# Altium schematic sheet MCU.SchDoc
size A
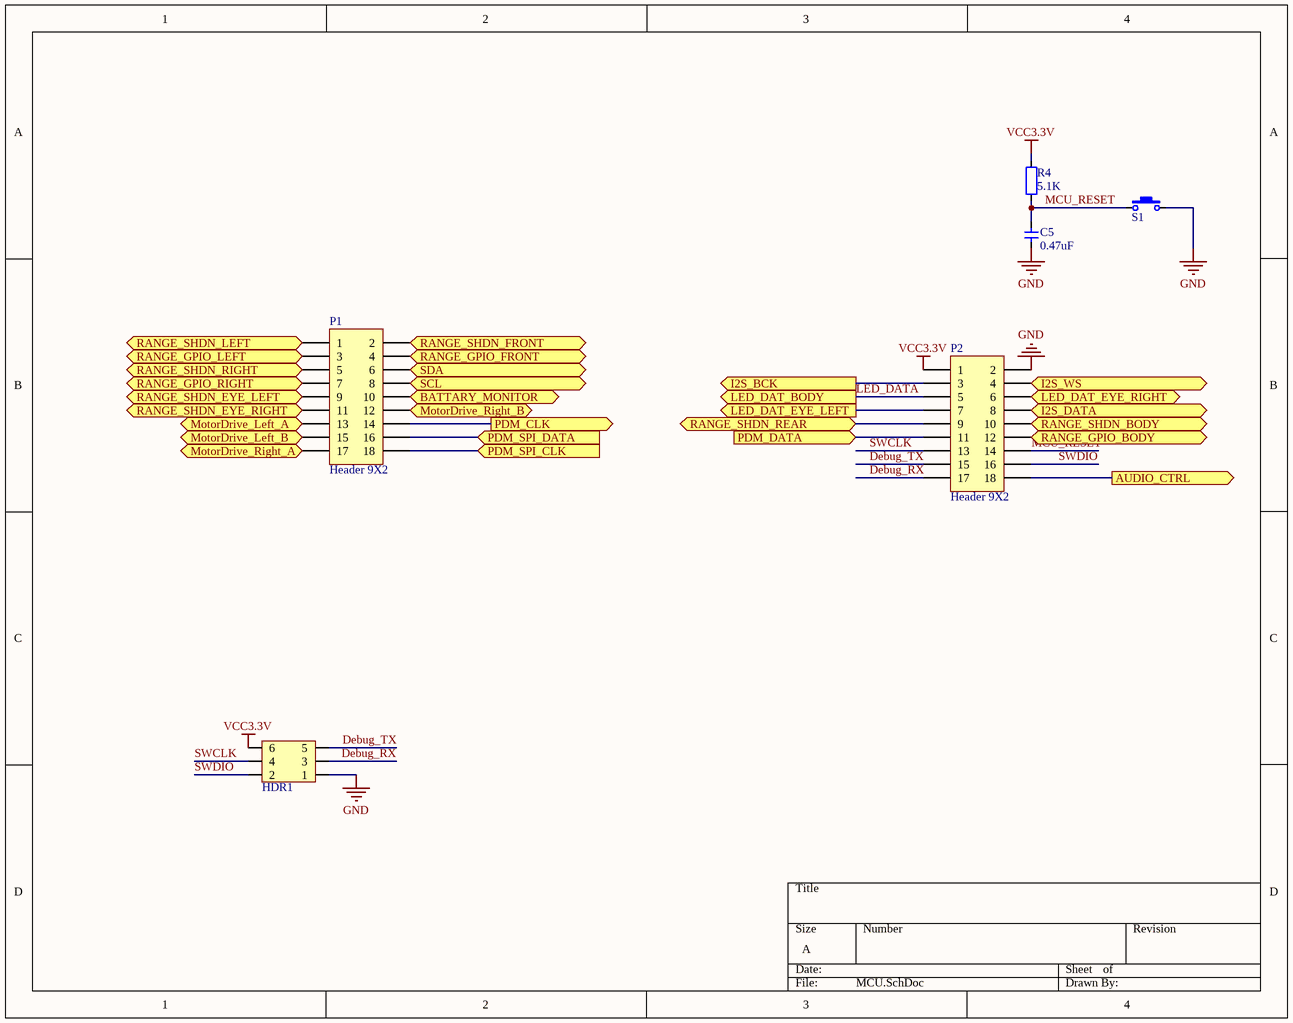
[diagram p0: MCU.SchDoc]

## Parts
C5  value 0.47uF  [CAP_0603]  (hidden comment: Cap_0603)
HDR1  HDR2x3_2.54  [HDR2X3_2.54_180]  (value not drawn)
P1  Header 9X2  [HDR2X9_2.00_180F]
P2  Header 9X2  [HDR2X9_2.00_180F]
R4  value 5.1K  [RES_0603]  (hidden comment: Res_0603)
S1  ButtonTACT_3x4x2_180  [ButtonTACT_3x4x2_180H]  (value not drawn)

## Ports
AUDIO_CTRL (out), BATTARY_MONITOR (in), I2S_BCK (out), I2S_DATA (out), I2S_WS (out), LED_DAT_BODY (out), LED_DAT_EYE_LEFT (out), LED_DAT_EYE_RIGHT (out), MotorDrive_Left_A (out), MotorDrive_Left_B (out), MotorDrive_Right_A (out), MotorDrive_Right_B (out), PDM_CLK (out), PDM_DATA (in), PDM_SPI_CLK (in), PDM_SPI_DATA (in), RANGE_GPIO_BODY, RANGE_GPIO_FRONT, RANGE_GPIO_LEFT, RANGE_GPIO_RIGHT, RANGE_SHDN_BODY, RANGE_SHDN_EYE_LEFT, RANGE_SHDN_EYE_RIGHT, RANGE_SHDN_FRONT, RANGE_SHDN_LEFT, RANGE_SHDN_REAR, RANGE_SHDN_RIGHT, SCL, SDA

## Nets
GND: C5.1 HDR1.1 P2.2 S1.2
VCC3.3V: HDR1.6 P2.1 R4.2
AUDIO_CTRL: P2.18 ; port AUDIO_CTRL
BATTARY_MONITOR: P1.10 ; port BATTARY_MONITOR
Debug_RX: HDR1.3 P2.17
Debug_TX: HDR1.5 P2.15
I2S_BCK: P2.3 ; port I2S_BCK
I2S_DATA: P2.8 ; port I2S_DATA
I2S_WS: P2.4 ; port I2S_WS
LED_DAT_EYE_LEFT: P2.7 ; port LED_DAT_EYE_LEFT
LED_DAT_EYE_RIGHT: P2.6 ; port LED_DAT_EYE_RIGHT
LED_DATA: P2.5 ; port LED_DAT_BODY
MCU_RESET: C5.2 P2.14 R4.1 S1.1
MotorDrive_Left_A: P1.13 ; port MotorDrive_Left_A
MotorDrive_Left_B: P1.15 ; port MotorDrive_Left_B
MotorDrive_Right_A: P1.17 ; port MotorDrive_Right_A
MotorDrive_Right_B: P1.12 ; port MotorDrive_Right_B
PDM_CLK: P1.14 ; port PDM_CLK
PDM_DATA: P2.11 ; port PDM_DATA
PDM_SPI_CLK: P1.18 ; port PDM_SPI_CLK
PDM_SPI_DATA: P1.16 ; port PDM_SPI_DATA
RANGE_GPIO_BODY: P2.12 ; port RANGE_GPIO_BODY
RANGE_GPIO_FRONT: P1.4 ; port RANGE_GPIO_FRONT
RANGE_GPIO_LEFT: P1.3 ; port RANGE_GPIO_LEFT
RANGE_GPIO_RIGHT: P1.7 ; port RANGE_GPIO_RIGHT
RANGE_SHDN_BODY: P2.10 ; port RANGE_SHDN_BODY
RANGE_SHDN_EYE_LEFT: P1.9 ; port RANGE_SHDN_EYE_LEFT
RANGE_SHDN_EYE_RIGHT: P1.11 ; port RANGE_SHDN_EYE_RIGHT
RANGE_SHDN_FRONT: P1.2 ; port RANGE_SHDN_FRONT
RANGE_SHDN_LEFT: P1.1 ; port RANGE_SHDN_LEFT
RANGE_SHDN_REAR: P2.9 ; port RANGE_SHDN_REAR
RANGE_SHDN_RIGHT: P1.5 ; port RANGE_SHDN_RIGHT
SCL: P1.8 ; port SCL
SDA: P1.6 ; port SDA
SWCLK: HDR1.4 P2.13
SWDIO: HDR1.2 P2.16

## Library data of the parts
C5 = Cap_0603: Capacitor
HDR1 = HDR2x3_2.54: Header
P1 P2 = Header 9X2: Header, 9-Pin, Dual row; LatestRevisionDate: 17-Jul-2002; LatestRevisionNote: Re-released for DXP Platform.; Publisher: Altium Limited
R4 = Res_0603: Resistor
S1 = ButtonTACT_3x4x2_180: Button